# EAGLE board rpi_stepper_motor_extention_board (EAGLE 9.2.2), part 1 of 2
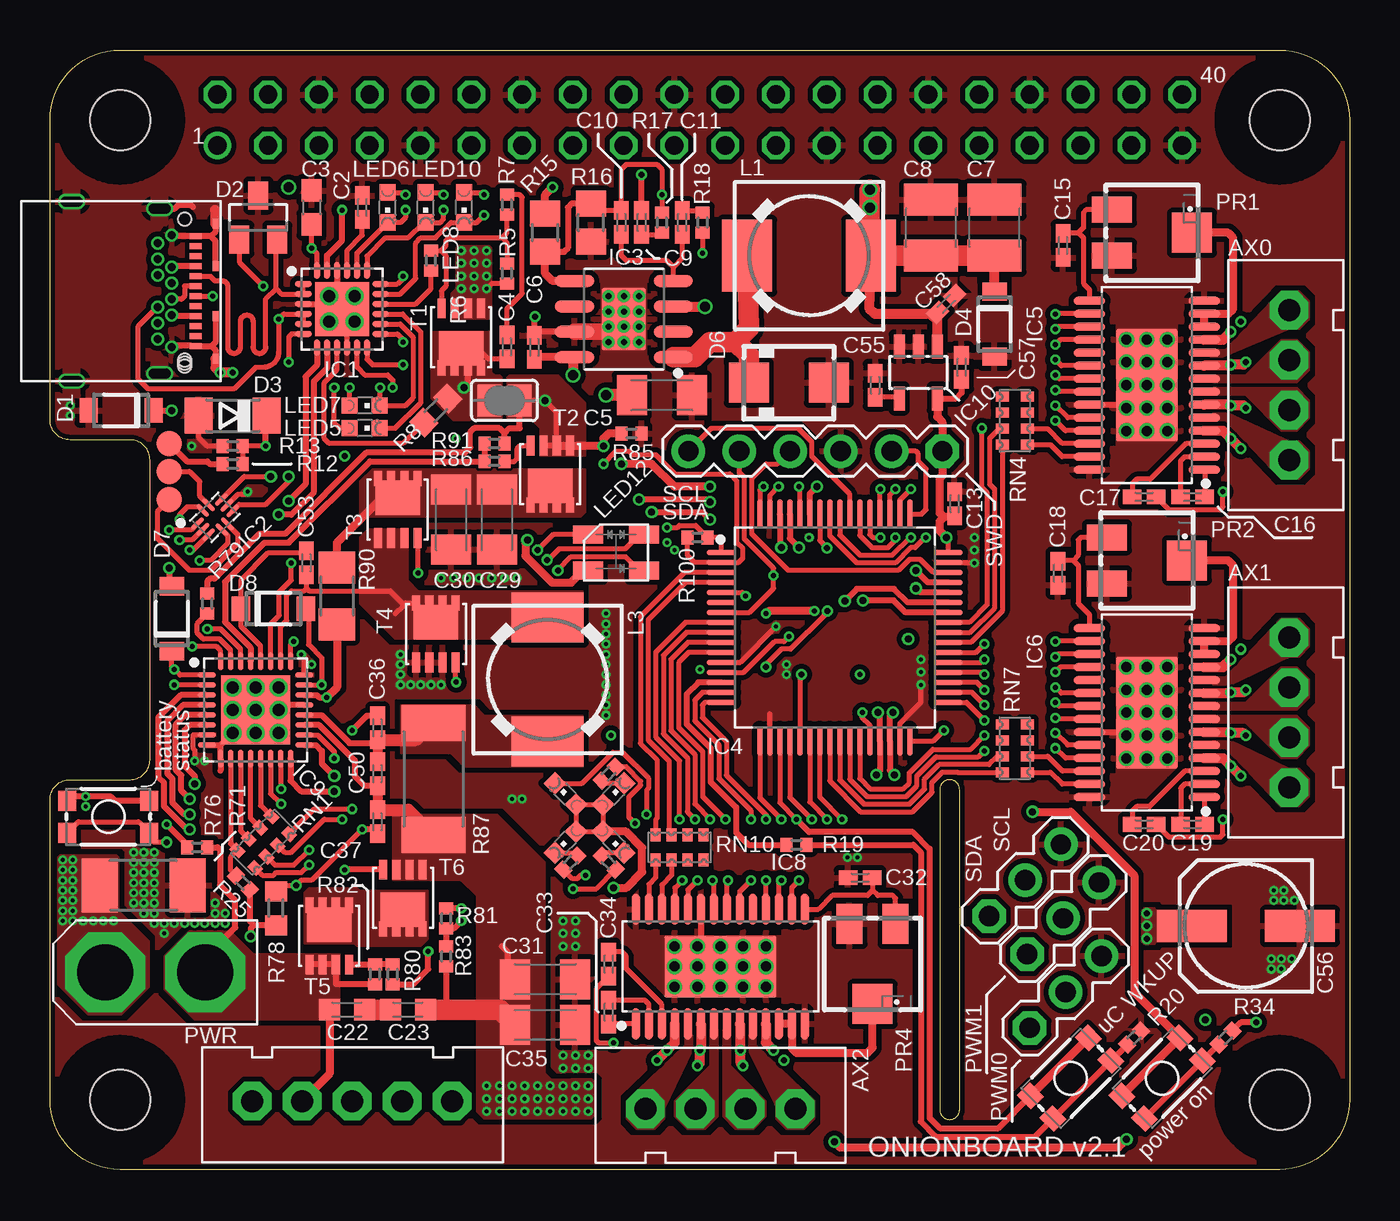
[diagram p4: board, top side]
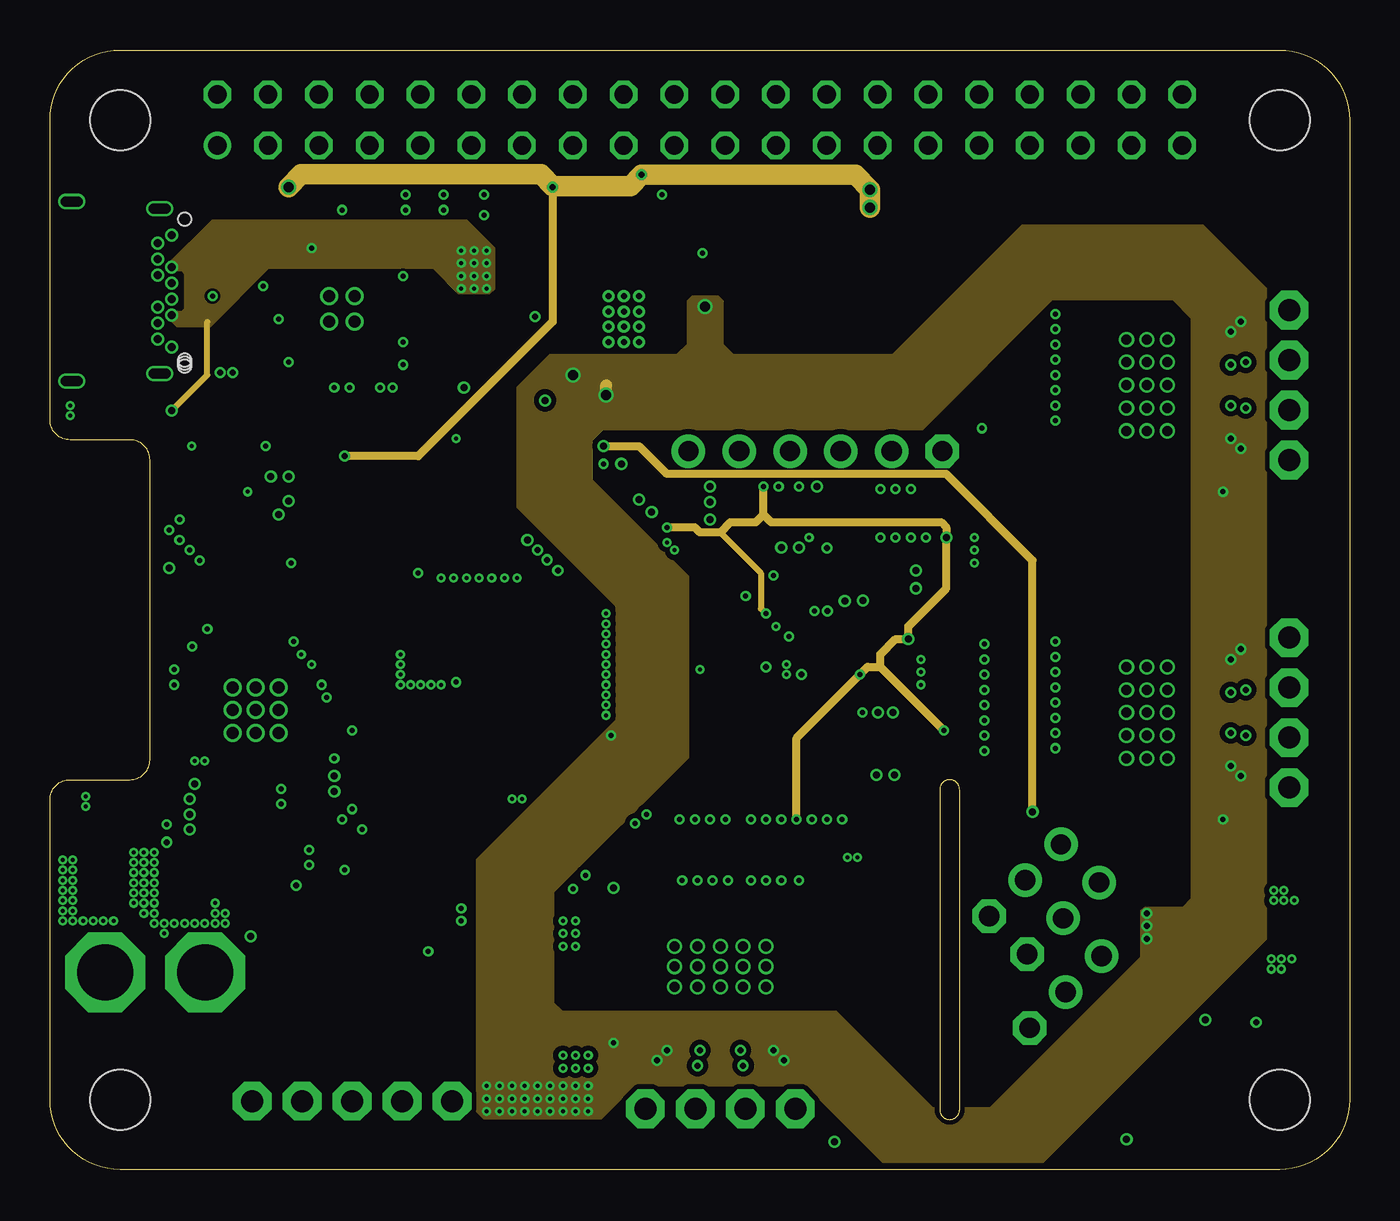
[diagram p5: board, inner layer VCC]
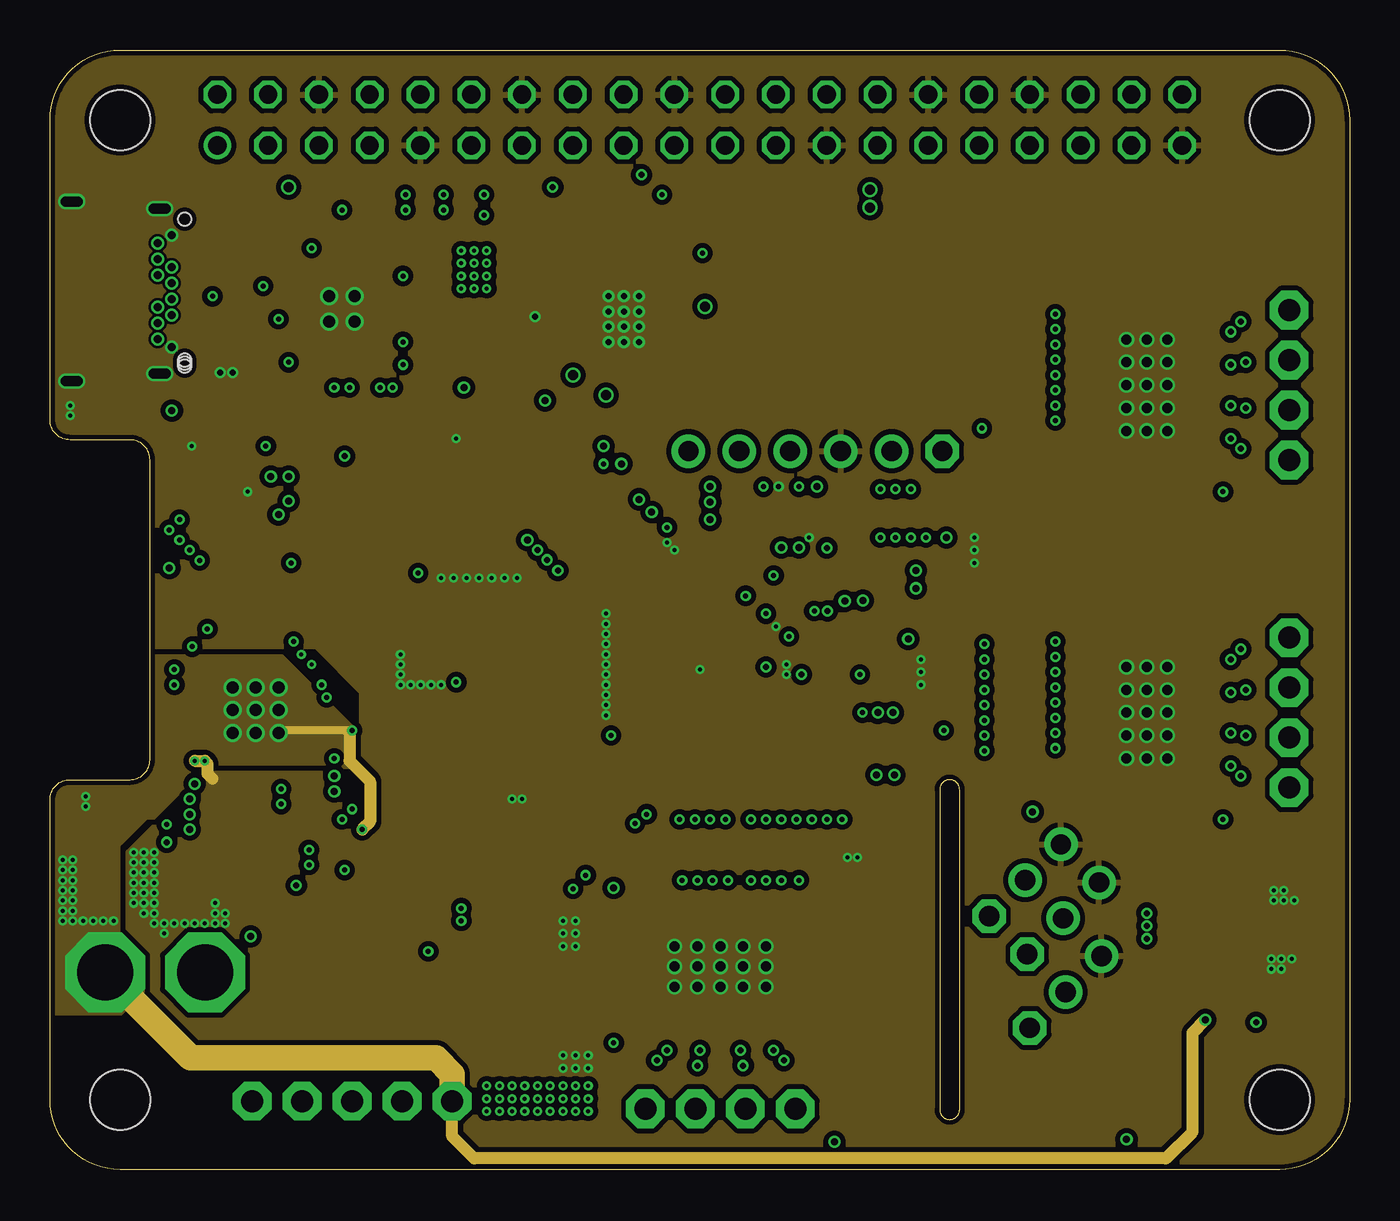
[diagram p6: board, inner layer GND]
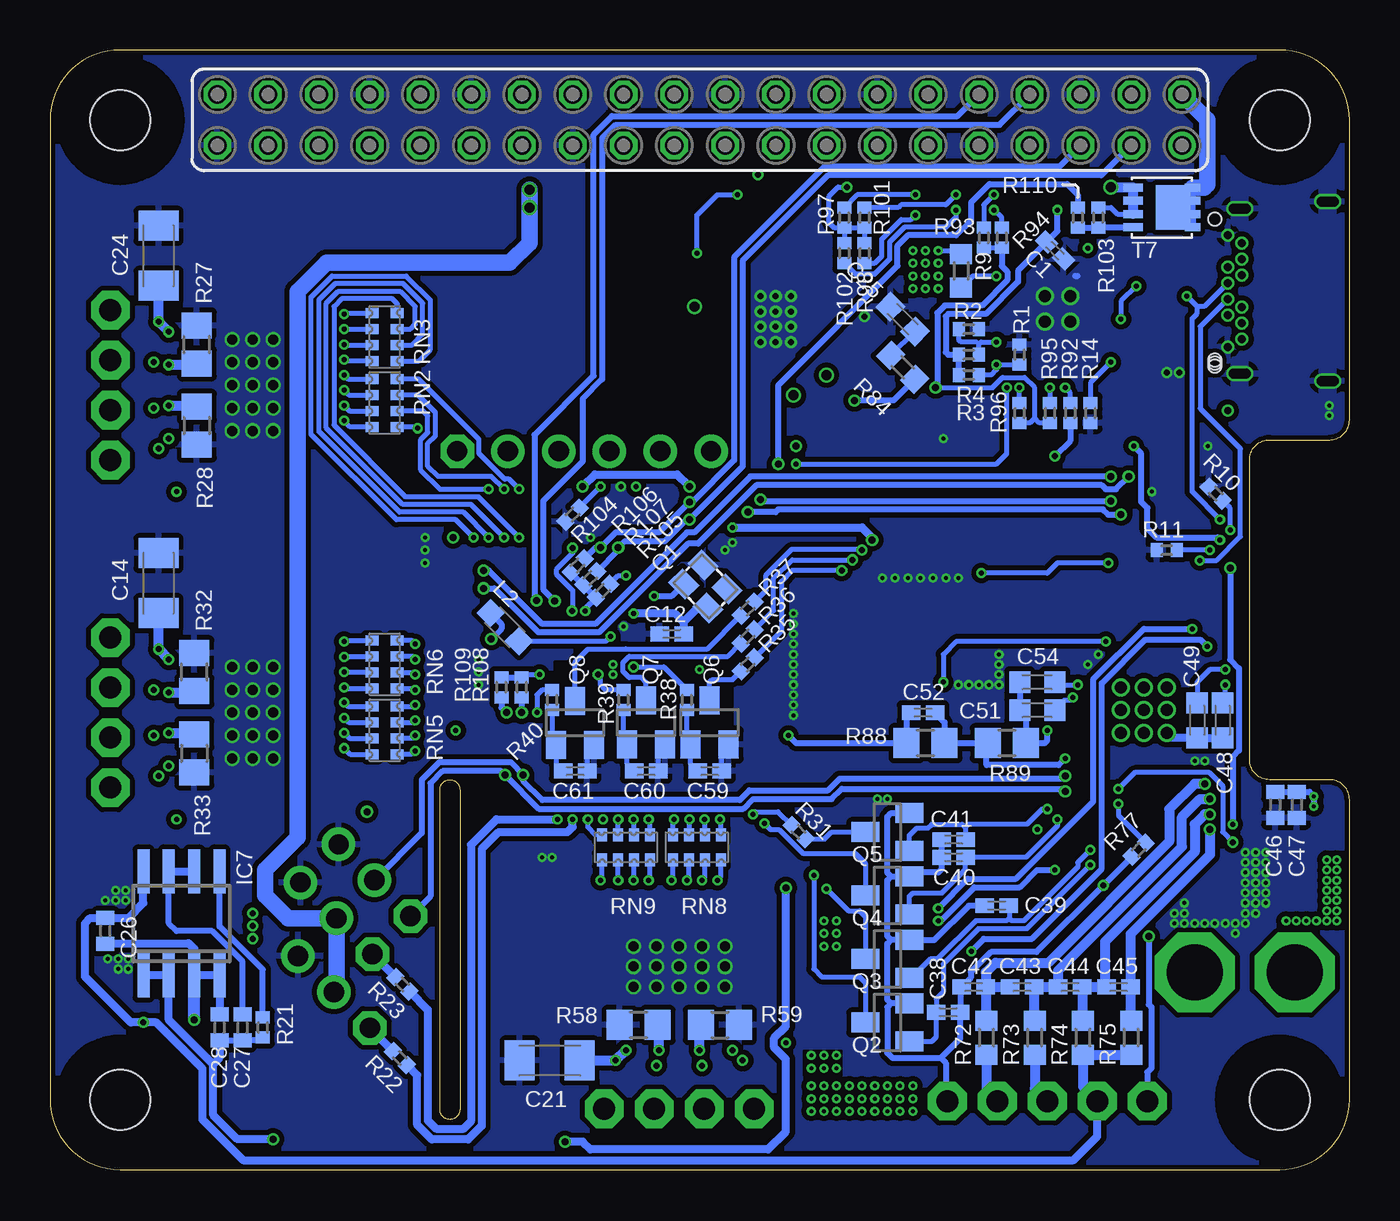
[diagram p7: board, bottom side, seen from below]

Size 65 x 56 mm. Coordinates in mm from the lower left corner, seen from the top.
Outline: 44.5,3 arc90 45,2.5 arc90 45.5,3 45.5,19 arc90 45,19.5 arc90 44.5,19 44.5,3
Outline: 61.5,0 3.5,0 arc-90 0,3.5 0,18.5 arc-90 1,19.5 4,19.5 arc90 5,20.5 5,35.5 arc90 4,36.5 1,36.5 arc-90 0,37.5 0,52.5 arc-90 3.5,56 61.5,56 arc-90 65,52.5 65,3.5 arc-90 61.5,0
Copper layers (1+2*15+16): Top 0.035mm / dielectric 0.2mm / VCC 0.035mm / dielectric 1mm / GND 0.035mm / dielectric 0.2mm / Bottom 0.035mm
Design rules "default *": minimum track width 6mil, minimum drill 0.19mm, track to track 5mil, track to pad 5mil, pad to pad 5mil, via to via 5mil, smd to smd 5mil, copper to edge 10mil, drill to drill 6mil, minimum pad ring 5mil, minimum via ring 5mil, stop-mask expansion 4mil, vias tented up to drill 0.225mm, thermal gap 10mil
Net classes: 0 default: width 0.254 mm, drill 0.2 mm, clearance 0.127 mm; 1 CC_USBC: width 0.254 mm, drill 0.25 mm, clearance 0.127 mm; 2 I2C_1: width 0.305 mm, drill 0.35 mm, clearance 0.127 mm; 3 I2C_0: width 0.305 mm, drill 0.35 mm, clearance 0.127 mm; 4 UART: width 0.305 mm, drill 0.35 mm, clearance 0.127 mm
Holes 3 mm at 3.5,3.5 3.5,52.5 61.5,3.5 61.5,52.5

## Footprints (pad centres in the part's own frame; a part is rotated, then mirrored left to right if it is on the bottom)
4PIN_CON_JOINT_TECH = drill 1.1 pad 1.93 octagon: 1 -3.75,0.13; 2 -1.25,0.13; 3 1.25,0.13; 4 3.75,0.13
C0402K = smd 0.925 x 0.74: 1 -0.6,0; 2 0.6,0
C0603 = smd 1.1 x 1: 1 -0.85,0; 2 0.85,0
C1206K = smd 1.5 x 2: 1 -1.5,0; 2 1.5,0
C1210 = smd 1.6 x 2.7: 1 -1.4,0; 2 1.4,0
C0603K = smd 1.05 x 1.08: 1 -0.875,0; 2 0.875,0
C0402 = smd 0.7 x 0.9: 1 -0.65,0; 2 0.65,0
153CLV-0605 = smd 3.5 x 1.6: + 2.7,0; - -2.7,0
USB-TYPE-C-HYBRID = smd 0.29 x 0.6: 1 -2.75,0.56; 2 -2.25,0.56; 3 -1.75,0.56; 4 -1.25,0.56; 5 -0.75,0.56; 6 -0.25,0.56; 7 0.25,0.56; 8 0.75,0.56; 9 1.25,0.56; 10 1.75,0.56; 11 2.25,0.56; 12 2.75,0.56 | drill 0.4 pad 0.59: B1 2.8,-0.65; B2 2.4,-1.35; B3 1.6,-1.35; B4 1.2,-0.65; B5 0.8,-1.35; B6 0.4,-0.65; B7 -0.4,-0.65; B8 -0.8,-1.35; B9 -1.2,-0.65; B10 -1.6,-1.35; B11 -2.4,-1.35; B12 -2.8,-0.65 | smd 0.5 x 0.3: P$1 1.25,1.55; P$2 3.38,1.55; P$3 -1.25,1.55; P$4 -3.37,1.55 | drill 0.5: P$7 -4.13,-0.95; P$8 -4.49,-5.34; P$9 4.49,-5.34; P$10 4.13,-0.95; P$11 -4.13,-1.05; P$12 -4.13,-1.15; P$13 -4.13,-1.25; P$14 -4.13,-1.25; P$15 -4.13,-1.35; P$16 -4.13,-1.45; P$17 -4.13,-1.55; P$18 4.13,-1.05; P$19 4.13,-1.15; P$20 4.13,-1.25; P$21 4.13,-1.35; P$22 4.13,-1.45; P$23 4.13,-1.55; P$24 -4.49,-5.44; P$25 -4.49,-5.54; P$26 -4.49,-5.64; P$27 -4.49,-5.74; P$28 -4.49,-5.84; P$29 -4.49,-5.94; P$30 4.49,-5.44; P$31 4.49,-5.54; P$32 4.49,-5.64; P$33 4.49,-5.74; P$34 4.49,-5.84; P$35 4.49,-5.94 | hole 0.65: -3.6,0; 3.45,0; 3.75,0; 3.6,0
SOD123FL = smd 0.91 x 1.22: A 1.625,0; C -1.625,0
SOT23 = smd 1 x 1.4: 1 -0.95,-1.1; 2 0.95,-1.1; 3 0,1.1
SOD80C = smd 1.4 x 1.8: A 1.7,0; C -1.7,0
SMA = smd 2 x 2: A 2,0; C -2,0
MA03-1 = drill 1.016 pad 1.676 octagon: 1 -2.54,0 | drill 1.016 pad 1.676: 2 0,0; 3 2.54,0
QFN50P400X400X90-25T270 = smd 0.835 x 0.292: 1 -1.933,1.25; 2 -1.933,0.75; 3 -1.933,0.25; 4 -1.933,-0.25; 5 -1.933,-0.75; 6 -1.933,-1.25; 13 1.933,-1.25; 14 1.933,-0.75; 15 1.933,-0.25; 16 1.933,0.25; 17 1.933,0.75; 18 1.933,1.25 | smd 0.292 x 0.835: 7 -1.25,-1.933; 8 -0.75,-1.933; 9 -0.25,-1.933; 10 0.25,-1.933; 11 0.75,-1.933; 12 1.25,-1.933; 19 1.25,1.933; 20 0.75,1.933; 21 0.25,1.933; 22 -0.25,1.933; 23 -0.75,1.933; 24 -1.25,1.933 | smd 2.7 x 2.7: EXP 0,0 | drill 0.6: P$1 -0.635,0.635; P$2 0.635,0.635; P$3 -0.635,-0.635; P$4 0.635,-0.635
QFN40P180X145X55-10 = smd 0.22 x 0.811: 1 -0.2,-0.676; 2 0.2,-0.676; 6 0.2,0.676; 7 -0.2,0.676 | smd 0.81 x 0.22: 3 0.845,-0.4; 4 0.845,0; 5 0.845,0.4; 8 -0.845,0.4; 9 -0.845,0; 10 -0.845,-0.4
SOIC127P600X170-8 = smd 1.968 x 0.599: 1 -2.473,1.905; 2 -2.473,0.635; 3 -2.473,-0.635; 4 -2.473,-1.905; 5 2.473,-1.905; 6 2.473,-0.635; 7 2.473,0.635; 8 2.473,1.905 | smd 2.2 x 3.1: EXP 0,0 | drill 0.3 pad 0.61: P$1 -0.762,1.143; P$2 0,1.143; P$3 0.762,1.143; P$4 -0.762,0.381; P$5 0,0.381; P$6 0.762,0.381; P$7 -0.762,-0.381; P$8 0,-0.381; P$9 0.762,-0.381; P$10 -0.762,-1.143; P$11 0,-1.143; P$12 0.762,-1.143
QFP50P1200X1200X160-64 = smd 1.469 x 0.28: 1 -5.671,3.75; 2 -5.671,3.25; 3 -5.671,2.75; 4 -5.671,2.25; 5 -5.671,1.75; 6 -5.671,1.25; 7 -5.671,0.75; 8 -5.671,0.25; 9 -5.671,-0.25; 10 -5.671,-0.75; 11 -5.671,-1.25; 12 -5.671,-1.75; 13 -5.671,-2.25; 14 -5.671,-2.75; 15 -5.671,-3.25; 16 -5.671,-3.75; 33 5.671,-3.75; 34 5.671,-3.25; 35 5.671,-2.75; 36 5.671,-2.25; 37 5.671,-1.75; 38 5.671,-1.25; 39 5.671,-0.75; 40 5.671,-0.25; 41 5.671,0.25; 42 5.671,0.75; 43 5.671,1.25; 44 5.671,1.75; 45 5.671,2.25; 46 5.671,2.75; 47 5.671,3.25; 48 5.671,3.75 | smd 0.28 x 1.469: 17 -3.75,-5.671; 18 -3.25,-5.671; 19 -2.75,-5.671; 20 -2.25,-5.671; 21 -1.75,-5.671; 22 -1.25,-5.671; 23 -0.75,-5.671; 24 -0.25,-5.671; 25 0.25,-5.671; 26 0.75,-5.671; 27 1.25,-5.671; 28 1.75,-5.671; 29 2.25,-5.671; 30 2.75,-5.671; 31 3.25,-5.671; 32 3.75,-5.671; 49 3.75,5.671; 50 3.25,5.671; 51 2.75,5.671; 52 2.25,5.671; 53 1.75,5.671; 54 1.25,5.671; 55 0.75,5.671; 56 0.25,5.671; 57 -0.25,5.671; 58 -0.75,5.671; 59 -1.25,5.671; 60 -1.75,5.671; 61 -2.25,5.671; 62 -2.75,5.671; 63 -3.25,5.671; 64 -3.75,5.671
SOP65P640X120-28 = smd 1.572 x 0.407: 1 -2.872,4.225; 2 -2.872,3.575; 3 -2.872,2.925; 4 -2.872,2.275; 5 -2.872,1.625; 6 -2.872,0.975; 7 -2.872,0.325; 8 -2.872,-0.325; 9 -2.872,-0.975; 10 -2.872,-1.625; 11 -2.872,-2.275; 12 -2.872,-2.925; 13 -2.872,-3.575; 14 -2.872,-4.225; 15 2.872,-4.225; 16 2.872,-3.575; 17 2.872,-2.925; 18 2.872,-2.275; 19 2.872,-1.625; 20 2.872,-0.975; 21 2.872,-0.325; 22 2.872,0.325; 23 2.872,0.975; 24 2.872,1.625; 25 2.872,2.275; 26 2.872,2.925; 27 2.872,3.575; 28 2.872,4.225 | smd 3.1 x 5.6: EXP 0,0 | drill 0.5: P$1 -1.016,2.286; P$2 0,2.286; P$3 1.016,2.286; P$4 -1.016,1.143; P$5 0,1.143; P$6 1.016,1.143; P$7 -1.016,0; P$8 0,0; P$9 1.016,0; P$10 -1.016,-1.143; P$11 0,-1.143; P$12 1.016,-1.143; P$13 -1.016,-2.286; P$14 0,-2.286; P$15 1.016,-2.286
SO08 = smd 0.6 x 2.2: 1 -1.905,-2.6; 2 -0.635,-2.6; 3 0.635,-2.6; 4 1.905,-2.6; 5 1.905,2.6; 6 0.635,2.6; 7 -0.635,2.6; 8 -1.905,2.6
QFN50P500X500X100-33T345 = smd 0.896 x 0.264: 1 -2.437,1.75; 2 -2.437,1.25; 3 -2.437,0.75; 4 -2.437,0.25; 5 -2.437,-0.25; 6 -2.437,-0.75; 7 -2.437,-1.25; 8 -2.437,-1.75; 17 2.437,-1.75; 18 2.437,-1.25; 19 2.437,-0.75; 20 2.437,-0.25; 21 2.437,0.25; 22 2.437,0.75; 23 2.437,1.25; 24 2.437,1.75 | smd 0.264 x 0.896: 9 -1.75,-2.437; 10 -1.25,-2.437; 11 -0.75,-2.437; 12 -0.25,-2.437; 13 0.25,-2.437; 14 0.75,-2.437; 15 1.25,-2.437; 16 1.75,-2.437; 25 1.75,2.437; 26 1.25,2.437; 27 0.75,2.437; 28 0.25,2.437; 29 -0.25,2.437; 30 -0.75,2.437; 31 -1.25,2.437; 32 -1.75,2.437 | smd 3.45 x 3.45: EXP 0,0 | drill 0.6: P$1 -1.143,1.143; P$2 0,1.143; P$3 1.143,1.143; P$4 -1.143,0; P$5 0,0; P$6 1.143,0; P$7 1.143,-1.143; P$8 0,-1.143; P$9 -1.143,-1.143
SOT23-DBV = smd 0.55 x 1.2: 1 -0.95,-1.3; 2 0,-1.3; 3 0.95,-1.3; 4 0.95,1.3; 5 -0.95,1.3
DR74 = smd 2.5 x 3.6: 1 -3.1,0; 2 3.1,0
L2012C = smd 1 x 1: 1 -1,0; 2 1,0
CHIPLED_0603 = smd 0.8 x 0.8: A 0,-0.75; C 0,0.75
CLV1A-FKB = smd 1.5 x 0.9: A -1.4,-0.9; B 1.4,-0.9; G 1.4,0.9; R -1.4,0.9
RTRIM3224J = smd 1.3 x 2: 1 -1.15,-2; 3 1.15,-2 | smd 2 x 2: 2 0,2
XT30PB-M = drill 2.8 pad 4 octagon: + -2.54,0; - 2.46,0
2.5X2.0_KXO-V95 = smd 1.2 x 1: 1 -0.85,-0.675; 2 0.85,-0.675; 3 0.85,0.675; 4 -0.85,0.675
R0402 = smd 0.6 x 0.7: 1 -0.5,0; 2 0.5,0
R0603 = smd 1 x 1.1: 1 -0.85,0; 2 0.85,0
R0805 = smd 1.3 x 1.5: 1 -0.95,0; 2 0.95,0
R2010 = smd 1.8 x 2.7: 1 -2.2,0; 2 2.2,0
R2512 = smd 1.8 x 3.2: 1 -2.8,0; 2 2.8,0
R1206 = smd 1.6 x 1.803: 1 -1.422,0; 2 1.422,0
0603-ARC = smd 0.5 x 0.65: 1 -1.2,-0.625; 2 -0.4,-0.625; 3 0.4,-0.625; 4 1.2,-0.625; 5 1.2,0.625; 6 0.4,0.625; 7 -0.4,0.625; 8 -1.2,0.625
TACTILE_SWITCH_SMD_4.6X2.8MM = smd 0.9 x 1: 1 -2.05,-0.8; 2 2.05,-0.8; 3 2.05,0.8; 4 -2.05,0.8
SJ = smd 1.168 x 1.6: 1 -0.762,0; 2 0.762,0
FE20-2 = drill 0.914: 1 -24.13,1.27 | drill 0.914 octagon: 2 -24.13,-1.27; 3 -21.59,1.27; 4 -21.59,-1.27; 5 -19.05,1.27; 6 -19.05,-1.27; 7 -16.51,1.27; 8 -16.51,-1.27; 9 -13.97,1.27; 10 -13.97,-1.27; 11 -11.43,1.27; 12 -11.43,-1.27; 13 -8.89,1.27; 14 -8.89,-1.27; 15 -6.35,1.27; 16 -6.35,-1.27; 17 -3.81,1.27; 18 -3.81,-1.27; 19 -1.27,1.27; 20 -1.27,-1.27; 21 1.27,1.27; 22 1.27,-1.27; 23 3.81,1.27; 24 3.81,-1.27; 25 6.35,1.27; 26 6.35,-1.27; 27 8.89,1.27; 28 8.89,-1.27; 29 11.43,1.27; 30 11.43,-1.27; 31 13.97,1.27; 32 13.97,-1.27; 33 16.51,1.27; 34 16.51,-1.27; 35 19.05,1.27; 36 19.05,-1.27; 37 21.59,1.27; 38 21.59,-1.27; 39 24.13,1.27; 40 24.13,-1.27
MA06-1 = drill 1.016 pad 1.676 octagon: 1 -6.35,0 | drill 1.016 pad 1.676: 2 -3.81,0; 3 -1.27,0; 4 1.27,0; 5 3.81,0; 6 6.35,0
POWERPAK1212-8 = smd 0.762 x 0.406: D1 1.549,0.991; D2 1.549,0.33; D3 1.549,-0.33; D4 1.549,-0.991 | smd 1.727 x 2.235: DPAD 0.584,0 | smd 0.991 x 0.406: G -1.422,-0.991; S1 -1.422,0.991; S2 -1.422,0.33; S3 -1.422,-0.33
B1,27 = smd 1.27 x 1.27: TP 0,0
5PIN_CON_JOINT_TECH = drill 1.1 pad 1.93 octagon: 1 -5,0.13; 2 -2.5,0.13; 3 0,0.13; 4 2.5,0.13; 5 5,0.13

## Placement (x,y rotation side)
AX0  4PIN_CON_JOINT_TECH  [4PIN_CON_JOINT_TECH]  61.85,39.23 270 top
AX1  4PIN_CON_JOINT_TECH  [4PIN_CON_JOINT_TECH]  61.85,22.85 270 top
AX2  4PIN_CON_JOINT_TECH  [4PIN_CON_JOINT_TECH]  33.53,3.17 180 top
C1  1uF  [C0402K]  14.73,45.97 135 bottom
C2  1uF  [C0402K]  15.62,48.12 270 top
C3  1uF  [C0603]  13.08,48.12 270 top
C4  100nF  [C0402K]  22.86,41.14 270 top
C5  10uF  [C1206K]  30.61,38.73 0 top
C6  100nf  [C0402K]  24.23,41.12 90 top
C7  10uF  [C1210]  47.24,47.11 90 top
C8  10uF  [C1210]  44.07,47.11 90 top
C9  2.2nF  [C0402K]  29.59,47.36 270 top
C10  1nF  [C0402K]  28.57,47.36 270 top
C11  22nF  [C0402K]  31.62,47.36 270 top
C12  100nF  [C0402K]  33.91,26.79 180 bottom
C13  100nF  [C0402K]  45.25,33.3 90 top
C14  10uF  [C1206K]  59.56,29.33 90 bottom
C15  470nF  [C0402K]  50.67,46.22 270 top
C16  10nF  [C0402K]  57.15,33.65 0 top
C17  100nF  [C0402K]  54.74,33.65 180 top
C18  470nF  [C0402K]  50.42,29.84 270 top
C19  10nF  [C0402K]  57.15,17.26 0 top
C20  100nF  [C0402K]  54.74,17.26 180 top
C21  10uF  [C1206K]  40.01,5.45 180 bottom
C22  100nF  [C0603K]  14.86,7.99 0 top
C23  100nF  [C0603K]  17.91,7.99 0 top
C24  10uF  [C1206K]  59.56,45.71 90 bottom
C25  2.2uF  [C0603K]  22.35,42.54 135 bottom
C26  1uf  [C0402]  62.23,11.93 270 bottom
C27  100pF  [C0402]  55.37,7.1 270 bottom
C28  1uf  [C0402]  56.52,7.1 90 bottom
C29  10uF  [C1206K]  22.35,32.5 270 top
C30  10uF  [C1206K]  20.07,32.5 270 top
C31  10uF  [C1206K]  24.77,9.52 0 top
C32  470nF  [C0402K]  40.51,14.6 180 top
C33  10nF  [C0402K]  27.94,7.87 270 top
C34  100nF  [C0402K]  27.94,10.28 90 top
C35  10uF  [C1206K]  24.77,7.23 0 top
C36  100nF  [C0402K]  16.38,22.09 90 top
C37  100nF  [C0402K]  16.38,17.39 270 top
C38  1uF  [C0402K]  20.07,7.87 0 bottom
C39  1uF  [C0402K]  17.65,13.2 180 bottom
C40  1uF  [C0402K]  19.81,15.61 180 bottom
C41  1uF  [C0402K]  19.81,16.5 180 bottom
C42  100nF  [C0402K]  18.8,9.14 0 bottom
C43  100nF  [C0402K]  16.38,9.14 0 bottom
C44  100nF  [C0402K]  13.97,9.14 0 bottom
C45  100nF  [C0402K]  11.56,9.14 0 bottom
C46  100nF  [C0402]  3.72,18.24 270 bottom
C47  100pF  [C0402]  2.63,18.24 270 bottom
C48  2.2uF  [C0603K]  6.35,22.47 270 bottom
C49  1uF  [C0603K]  7.62,22.47 270 bottom
C50  100nF  [C0402K]  16.38,19.8 270 top
C51  1uF  [C0603K]  15.62,22.98 180 bottom
C52  22pF  [C0402K]  21.34,22.85 0 bottom
C53  100nF  [C0402K]  12.83,30.34 270 top
C54  1uF  [C0603K]  15.62,24.38 180 bottom
C55  10nF  [C0402K]  41.27,39.23 90 top
C56  220uF  [153CLV-0605]  59.82,12.18 180 top
C57  1uF  [C0402K]  45.59,40.12 90 top
C58  100nF  [C0402K]  44.83,43.3 45 top
C59  1uF  [C0402K]  32,19.93 0 bottom
C60  1uF  [C0402K]  35.18,19.93 0 bottom
C61  1uF  [C0402K]  38.73,19.93 0 bottom
CON1  USB-TYPE-CHYBRID  [USB-TYPE-C-HYBRID]  6.73,43.93 270 top
D1  SUPP  [SOD123FL]  3.56,37.97 180 top
D2  SUPP  [SOT23]  10.41,47.62 0 top
D3  3v3  [SOD80C]  9.14,37.71 180 top
D4  SUPP  [SOD123FL]  47.24,42.28 270 top
D6  MBRA340T3  [SMA]  36.96,39.36 0 top
D7  BAT54  [SOD123FL]  6.1,27.55 90 top
D8  BAT54  [SOD123FL]  11.18,28.06 0 top
I2C1  [MA03-1]  48.77,14.47 45 top
IC1  STUSB4500  [QFN50P400X400X90-25T270]  14.61,43.05 0 top
IC2  TS3USB30  [QFN40P180X145X55-10]  8.26,32.63 45 top
IC3  L7985  [SOIC127P600X170-8]  28.7,42.54 180 top
IC4  STM32F103RBT6  [QFP50P1200X1200X160-64]  39.25,27.11 0 top
IC5  DRV8825  [SOP65P640X120-28]  54.86,39.23 180 top
IC6  DRV8825  [SOP65P640X120-28]  54.86,22.85 180 top
IC7  LP2951D  [SO08]  58.42,12.31 0 bottom
IC8  DRV8825  [SOP65P640X120-28]  33.53,10.15 90 top
IC9  BQ40Z60  [QFN50P500X500X100-33T345]  10.29,22.98 0 top
IC10  TPS77033  [SOT23-DBV]  43.43,39.87 180 top
L1  DR74  [DR74]  37.97,45.71 0 top
L2  [L2012C]  42.25,27.13 315 bottom
L3  2u2  [DR74]  24.89,24.5 270 top
LED1  [CHIPLED_0603]  25.78,16.38 135 top
LED2  [CHIPLED_0603]  28.19,16.38 225 top
LED3  [CHIPLED_0603]  28.19,18.79 315 top
LED4  [CHIPLED_0603]  25.78,18.79 45 top
LED5  [CHIPLED_0603]  15.75,37.08 270 top
LED6  [CHIPLED_0603]  16.89,48.12 180 top
LED7  [CHIPLED_0603]  15.75,38.22 270 top
LED8  [CHIPLED_0603]  20.7,48.12 180 top
LED10  [CHIPLED_0603]  18.8,48.12 180 top
LED12  CLV1A-FKB  [CLV1A-FKB]  28.32,30.85 0 top
PR1  [RTRIM3224J]  55.12,46.86 270 top
PR2  [RTRIM3224J]  54.86,30.47 270 top
PR4  [RTRIM3224J]  41.15,10.28 180 top
PWM0  [MA03-1]  50.8,8.88 45 top
PWM1  [MA03-1]  50.67,12.56 45 top
PWR  XT30PB-M  [XT30PB-M]  5.21,9.86 180 top
Q1  [2.5X2.0_KXO-V95]  32.22,29.16 135 bottom
Q2  BSS123  [SOT23]  23.11,7.36 90 bottom
Q3  BSS123  [SOT23]  23.11,10.53 90 bottom
Q4  BSS123  [SOT23]  23.11,13.71 90 bottom
Q5  BSS123  [SOT23]  23.11,16.88 90 bottom
Q6  BSS123  [SOT23]  32,22.35 0 bottom
Q7  BSS123  [SOT23]  35.18,22.35 0 bottom
Q8  BSS123  [SOT23]  38.73,22.34 0 bottom
R1  100k  [R0402]  16.51,40.76 270 bottom
R2  100k  [R0402]  19.05,42.03 180 bottom
R3  100k  [R0402]  19.05,39.74 0 bottom
R4  100k  [R0402]  19.05,40.76 0 bottom
R5  100k  [R0402]  22.86,44.82 270 top
R6  22k  [R0402]  19.05,45.46 90 top
R7  22k  [R0402]  22.86,48.25 90 top
R8  1k  [R0603]  19.3,37.97 45 top
R9  1k  [R0603]  19.43,44.95 90 bottom
R10  10k  [R0402]  6.69,33.81 315 bottom
R11  10k  [R0402]  9.14,30.98 0 bottom
R12  4k7  [R0402]  9.14,35.3 180 top
R13  10k  [R0402]  9.14,36.19 180 top
R14  100k  [R0402]  12.95,37.84 90 bottom
R15  5k1  [R0805]  24.77,46.86 90 top
R16  698  [R0805]  27.05,47.36 90 top
R17  100  [R0402]  30.61,47.36 270 top
R18  1k  [R0402]  32.64,47.36 90 top
R19  1k  [R0402]  37.34,16.25 0 top
R20  100k  [R0402]  54.23,6.6 225 top
R21  332k  [R0402]  54.36,7.1 90 bottom
R22  1k  [R0402]  47.5,5.58 135 bottom
R23  1k  [R0402]  47.37,9.26 135 bottom
R25  4k7  [R0402]  9.65,14.34 315 top
R26  1k  [R0402]  26.04,15.36 225 top
R27  0,1  [R0805]  57.66,41.27 90 bottom
R28  0,1  [R0805]  57.66,37.2 270 bottom
R29  1k  [R0402]  27.94,15.36 315 top
R30  1k  [R0402]  27.94,19.8 45 top
R31  1k  [R0402]  27.56,16.88 315 bottom
R32  0,1  [R0805]  57.78,24.88 90 bottom
R33  0,1  [R0805]  57.78,20.82 270 bottom
R34  4k7  [R0402]  58.8,6.6 45 top
R35  1k  [R0402]  30.1,25.27 225 bottom
R36  1k  [R0402]  30.1,26.66 225 bottom
R37  1k  [R0402]  30.1,28.06 225 bottom
R38  1k  [R0402]  33.15,23.49 270 bottom
R39  1k  [R0402]  36.32,23.49 270 bottom
R40  1k  [R0402]  39.88,23.49 270 bottom
R58  0,1  [R0805]  35.56,7.23 180 bottom
R59  0,1  [R0805]  31.5,7.23 0 bottom
R71  0.005  [R2010]  4.7,14.22 180 top
R72  100  [R0603]  18.16,6.6 90 bottom
R73  100  [R0603]  15.75,6.6 90 bottom
R74  100  [R0603]  13.34,6.6 90 bottom
R75  100  [R0603]  10.92,6.6 90 bottom
R76  10  [R0402]  7.37,16.12 0 top
R77  1k  [R0402]  10.54,15.99 45 bottom
R78  NTC-10k  [R0603]  11.3,13.07 270 top
R79  10k  [R0402]  7.87,28.31 90 top
R80  4k7  [R0402]  17.14,9.77 90 top
R81  4k7  [R0402]  19.81,12.56 270 top
R82  10M  [R0402]  16.26,9.77 270 top
R83  10M  [R0402]  19.81,10.66 270 top
R84  2  [R0603]  22.35,40.12 315 bottom
R85  100k  [R0402]  29.08,36.82 180 top
R86  4k7  [R0402]  22.23,35.42 0 top
R87  0.01  [R2512]  19.18,19.55 270 top
R88  332k  [R0805]  21.21,21.33 180 bottom
R89  35,6k  [R0805]  17.14,21.33 180 bottom
R90  10  [R1206]  14.35,28.69 90 top
R91  10M  [R0402]  22.23,36.31 0 top
R92  2k2  [R0402]  13.97,37.84 270 bottom
R93  2k2  [R0402]  18.29,46.6 90 bottom
R94  100k  [R0402]  17.4,46.6 270 bottom
R95  2k2  [R0402]  14.99,37.84 90 bottom
R96  100k  [R0402]  16.51,37.84 270 bottom
R97  2k2  [R0402]  25.27,47.62 90 bottom
R98  100k  [R0402]  24.26,45.84 90 bottom
R100  100k  [R0402]  32.38,31.61 0 top
R101  2k2  [R0402]  24.26,47.62 90 bottom
R102  100k  [R0402]  25.27,45.84 90 bottom
R103  10M  [R0402]  12.57,47.62 90 bottom
R104  10k  [R0402]  38.86,32.76 45 bottom
R105  10k  [R0402]  37.34,28.95 225 bottom
R106  10k  [R0402]  38.61,30.22 225 bottom
R107  10k  [R0402]  37.97,29.58 225 bottom
R108  10k  [R0402]  41.4,24.12 90 bottom
R109  10k  [R0402]  42.42,24.12 90 bottom
R110  1k  [R0402]  13.59,47.62 270 bottom
RN1  330k  [0603-ARC]  10.67,16.38 45 top
RN2  1k  [0603-ARC]  48.26,38.35 90 bottom
RN3  1k  [0603-ARC]  48.26,41.65 90 bottom
RN4  1k  [0603-ARC]  48.26,37.46 90 top
RN5  1k  [0603-ARC]  48.26,21.96 90 bottom
RN6  1k  [0603-ARC]  48.26,25.27 90 bottom
RN7  1k  [0603-ARC]  48.26,21.07 90 top
RN8  1k  [0603-ARC]  32.64,16.12 180 bottom
RN9  1k  [0603-ARC]  36.2,16.12 180 bottom
RN10  1k  [0603-ARC]  31.5,16.12 0 top
S1  [TACTILE_SWITCH_SMD_4.6X2.8MM]  2.92,17.64 0 top
S2  [TACTILE_SWITCH_SMD_4.6X2.8MM]  51.05,4.56 45 top
S5  [TACTILE_SWITCH_SMD_4.6X2.8MM]  55.63,4.56 45 top
SJ1  [SJ]  22.73,38.47 0 top
SV1  [FE20-2]  32.5,52.5 180 bottom
SWD  [MA06-1]  38.28,35.94 180 top
T1  STL6PLLH6  [POWERPAK1212-8]  20.57,41.65 270 top
T2  CSD17308  [POWERPAK1212-8]  25.02,34.79 270 top
T3  CSD17308  [POWERPAK1212-8]  17.4,33.01 90 top
T4  CSD17308  [POWERPAK1212-8]  19.3,26.79 90 top
T5  CSD17308  [POWERPAK1212-8]  13.97,11.68 90 top
T6  CSD17308  [POWERPAK1212-8]  17.65,13.58 270 top
T7  IRFHM9331  [POWERPAK1212-8]  9.4,48.12 0 bottom
TP3  TPB1,27  [B1,27]  5.97,33.52 0 top
TP4  TPB1,27  [B1,27]  5.97,34.92 0 top
TP5  TPB1,27  [B1,27]  5.97,36.31 0 top
U$1  5PIN_CON_JOINT_TECH  [5PIN_CON_JOINT_TECH]  15.11,3.29 0 top